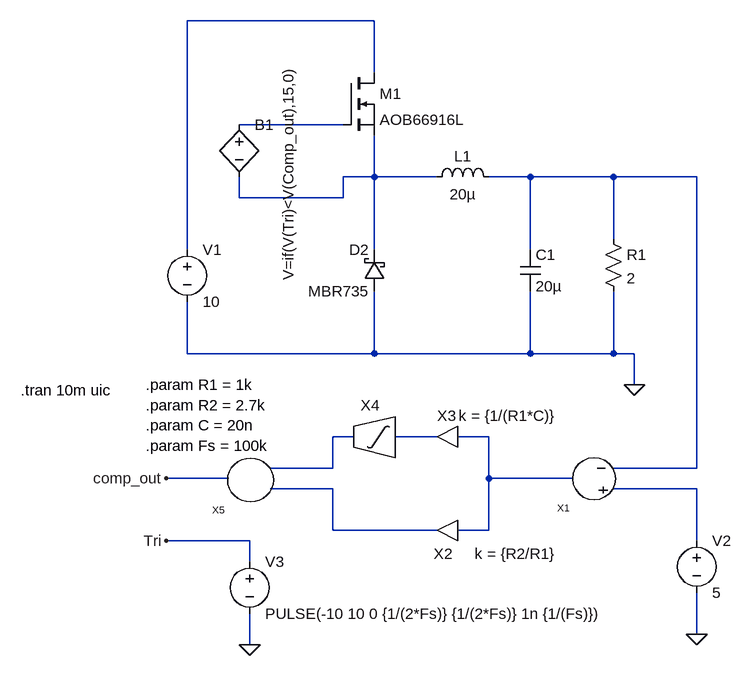
[diagram p0: schematic Buck Converter Closed Loop.asc]
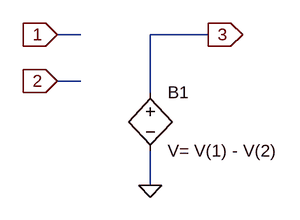
[diagram p1: sub-circuit sub.asc]
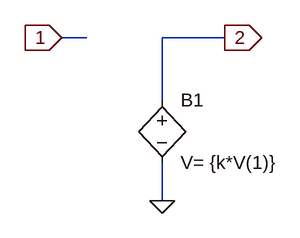
[diagram p2: sub-circuit gain.asc]
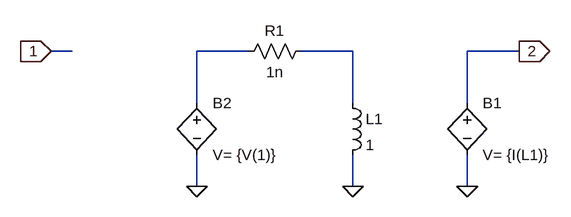
[diagram p3: sub-circuit integrate.asc]
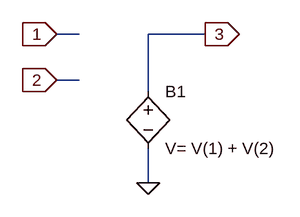
[diagram p4: sub-circuit adder.asc]
Buck Converter Closed Loop.asc, the LTspice schematic file:
Version 4
SHEET 1 880 756
WIRE 320 -224 32 -224
WIRE 320 -144 320 -224
WIRE 272 -64 112 -64
WIRE 320 16 320 -48
WIRE 320 16 272 16
WIRE 416 16 320 16
WIRE 560 16 496 16
WIRE 688 16 560 16
WIRE 816 16 688 16
WIRE 112 48 112 16
WIRE 272 48 272 16
WIRE 272 48 112 48
WIRE 688 112 688 16
WIRE 32 128 32 -224
WIRE 320 128 320 16
WIRE 560 128 560 16
WIRE 32 288 32 208
WIRE 320 288 320 192
WIRE 320 288 32 288
WIRE 560 288 560 192
WIRE 560 288 320 288
WIRE 688 288 688 192
WIRE 688 288 560 288
WIRE 720 288 688 288
WIRE 720 336 720 288
WIRE 288 416 256 416
WIRE 416 416 352 416
WIRE 496 416 448 416
WIRE 256 464 256 416
WIRE 256 464 160 464
WIRE 816 464 816 16
WIRE 816 464 688 464
WIRE 96 480 0 480
WIRE 496 480 496 416
WIRE 624 480 496 480
WIRE 256 496 160 496
WIRE 816 496 688 496
WIRE 256 560 256 496
WIRE 416 560 256 560
WIRE 496 560 496 480
WIRE 496 560 448 560
WIRE 128 576 0 576
WIRE 816 576 816 496
WIRE 128 608 128 576
WIRE 816 720 816 656
WIRE 128 736 128 688
FLAG 816 720 0
FLAG 128 736 0
FLAG 0 480 comp_out
FLAG 720 336 0
FLAG 0 576 Tri
SYMBOL voltage 32 112 R0
WINDOW 123 0 0 Left 0
WINDOW 39 0 0 Left 0
SYMATTR InstName V1
SYMATTR Value 10
SYMBOL ind 400 32 R270
WINDOW 0 32 56 VTop 2
WINDOW 3 5 56 VBottom 2
SYMATTR InstName L1
SYMATTR Value 20µ
SYMBOL cap 544 128 R0
SYMATTR InstName C1
SYMATTR Value 20µ
SYMBOL res 672 96 R0
SYMATTR InstName R1
SYMATTR Value 2
SYMBOL sub 736 480 R180
SYMATTR InstName X1
SYMBOL voltage 816 560 R0
WINDOW 123 0 0 Left 0
WINDOW 39 0 0 Left 0
SYMATTR InstName V2
SYMATTR Value 5
SYMBOL Gain 496 416 R180
WINDOW 0 65 48 Bottom 2
WINDOW 39 -29 48 Bottom 2
SYMATTR InstName X3
SYMATTR SpiceLine k = {1/(R1*C)}
SYMBOL Gain 496 560 R180
WINDOW 0 70 -20 Bottom 2
WINDOW 39 -41 -20 Bottom 2
SYMATTR InstName X2
SYMATTR SpiceLine k = {R2/R1}
SYMBOL Integrate 304 464 R180
WINDOW 0 -10 112 Bottom 2
SYMATTR InstName X4
SYMBOL Adder 144 480 R180
SYMATTR InstName X5
SYMBOL voltage 128 592 R0
WINDOW 123 0 0 Left 0
WINDOW 39 0 0 Left 0
SYMATTR InstName V3
SYMATTR Value PULSE(-10 10 0 {1/(2*Fs)} {1/(2*Fs)} 1n {1/(Fs)})
SYMBOL bv 112 -80 R0
WINDOW 3 76 -76 VRight 2
SYMATTR InstName B1
SYMATTR Value V=if(V(Tri)<V(Comp_out),15,0)
SYMBOL schottky 336 192 R180
WINDOW 0 24 64 Left 2
WINDOW 3 24 0 Left 2
SYMATTR InstName D2
SYMATTR Value MBR735
SYMBOL nmos 272 -144 R0
SYMATTR InstName M1
SYMATTR Value AOB66916L
TEXT -32 336 Left 2 !.param R1 = 1k\n.param R2 = 2.7k\n.param C = 20n\n.param Fs = 100k
TEXT -224 344 Left 2 !.tran 10m uic

sub.asc, the sub-circuit schematic file:
Version 4
SHEET 1 880 680
WIRE 192 -16 160 -16
WIRE 368 -16 288 -16
WIRE 192 48 160 48
WIRE 288 64 288 -16
WIRE 288 192 288 144
FLAG 160 -16 1
IOPIN 160 -16 In
FLAG 160 48 2
IOPIN 160 48 In
FLAG 368 -16 3
IOPIN 368 -16 Out
FLAG 288 192 0
SYMBOL bv 288 48 R0
SYMATTR InstName B1
SYMATTR Value V= V(1) - V(2)

gain.asc, the sub-circuit schematic file:
Version 4
SHEET 1 880 680
WIRE 96 48 64 48
WIRE 272 48 192 48
WIRE 192 128 192 48
WIRE 192 256 192 208
FLAG 64 48 1
IOPIN 64 48 In
FLAG 272 48 2
IOPIN 272 48 Out
FLAG 192 256 0
SYMBOL bv 192 112 R0
SYMATTR InstName B1
SYMATTR Value V= {k*V(1)}

integrate.asc, the sub-circuit schematic file:
Version 4
SHEET 1 880 680
WIRE -176 48 -208 48
WIRE 96 48 16 48
WIRE 256 48 176 48
WIRE 512 48 432 48
WIRE 16 128 16 48
WIRE 256 128 256 48
WIRE 432 128 432 48
WIRE 16 256 16 208
WIRE 256 256 256 208
WIRE 432 256 432 208
FLAG -208 48 1
IOPIN -208 48 In
FLAG 512 48 2
IOPIN 512 48 Out
FLAG 432 256 0
FLAG 16 256 0
FLAG 256 256 0
SYMBOL bv 432 112 R0
SYMATTR InstName B1
SYMATTR Value V= {I(L1)}
SYMBOL bv 16 112 R0
SYMATTR InstName B2
SYMATTR Value V= {V(1)}
SYMBOL res 192 32 R90
WINDOW 0 0 56 VBottom 2
WINDOW 3 32 56 VTop 2
SYMATTR InstName R1
SYMATTR Value 1n
SYMBOL ind 240 112 R0
SYMATTR InstName L1
SYMATTR Value 1

adder.asc, the sub-circuit schematic file:
Version 4
SHEET 1 880 680
WIRE 176 112 144 112
WIRE 352 112 272 112
WIRE 176 176 144 176
WIRE 272 192 272 112
WIRE 272 320 272 272
FLAG 144 112 1
IOPIN 144 112 In
FLAG 144 176 2
IOPIN 144 176 In
FLAG 352 112 3
IOPIN 352 112 Out
FLAG 272 320 0
SYMBOL bv 272 176 R0
SYMATTR InstName B1
SYMATTR Value V= V(1) + V(2)

The netlist it stands for:
* Buck Converter Closed Loop.asc
V1 N001 0 10
L1 N003 N004 20µ
C1 N004 0 20µ
R1 N004 0 2
XX1 N009 N004 N007 sub
V2 N009 0 5
XX3 N007 N006 gain params: k = {1/(R1*C)}
XX2 N007 N008 gain params: k = {R2/R1}
XX4 N006 N005 integrate
XX5 N008 N005 comp_out adder
V3 Tri 0 PULSE(-10 10 0 {1/(2*Fs)} {1/(2*Fs)} 1n {1/(Fs)})
B1 N002 N003 V=if(V(Tri)<V(Comp_out),15,0)
D2 0 N003 MBR735
M1 N001 N002 N003 N003 AOB66916L

* block symbol definitions
.subckt sub 1 2 3
B1 3 0 V= V(1) - V(2)
.ends sub

.subckt gain 1 2
B1 2 0 V= {k*V(1)}
.ends gain

.subckt integrate 1 2
B1 2 0 V= {I(L1)}
B2 N001 0 V= {V(1)}
R1 N002 N001 1n
L1 N002 0 1
.ends integrate

.subckt adder 1 2 3
B1 3 0 V= V(1) + V(2)
.ends adder

.model D D
.lib standard.dio
.model NMOS NMOS
.model PMOS PMOS
.lib standard.mos
.param R1 = 1k
.param R2 = 2.7k
.param C = 20n
.param Fs = 100k
.tran 10m uic
.backanno
.end